# EAGLE design SparkFun_RF_Transceiver-RFM22B (EAGLE 7.2.0)
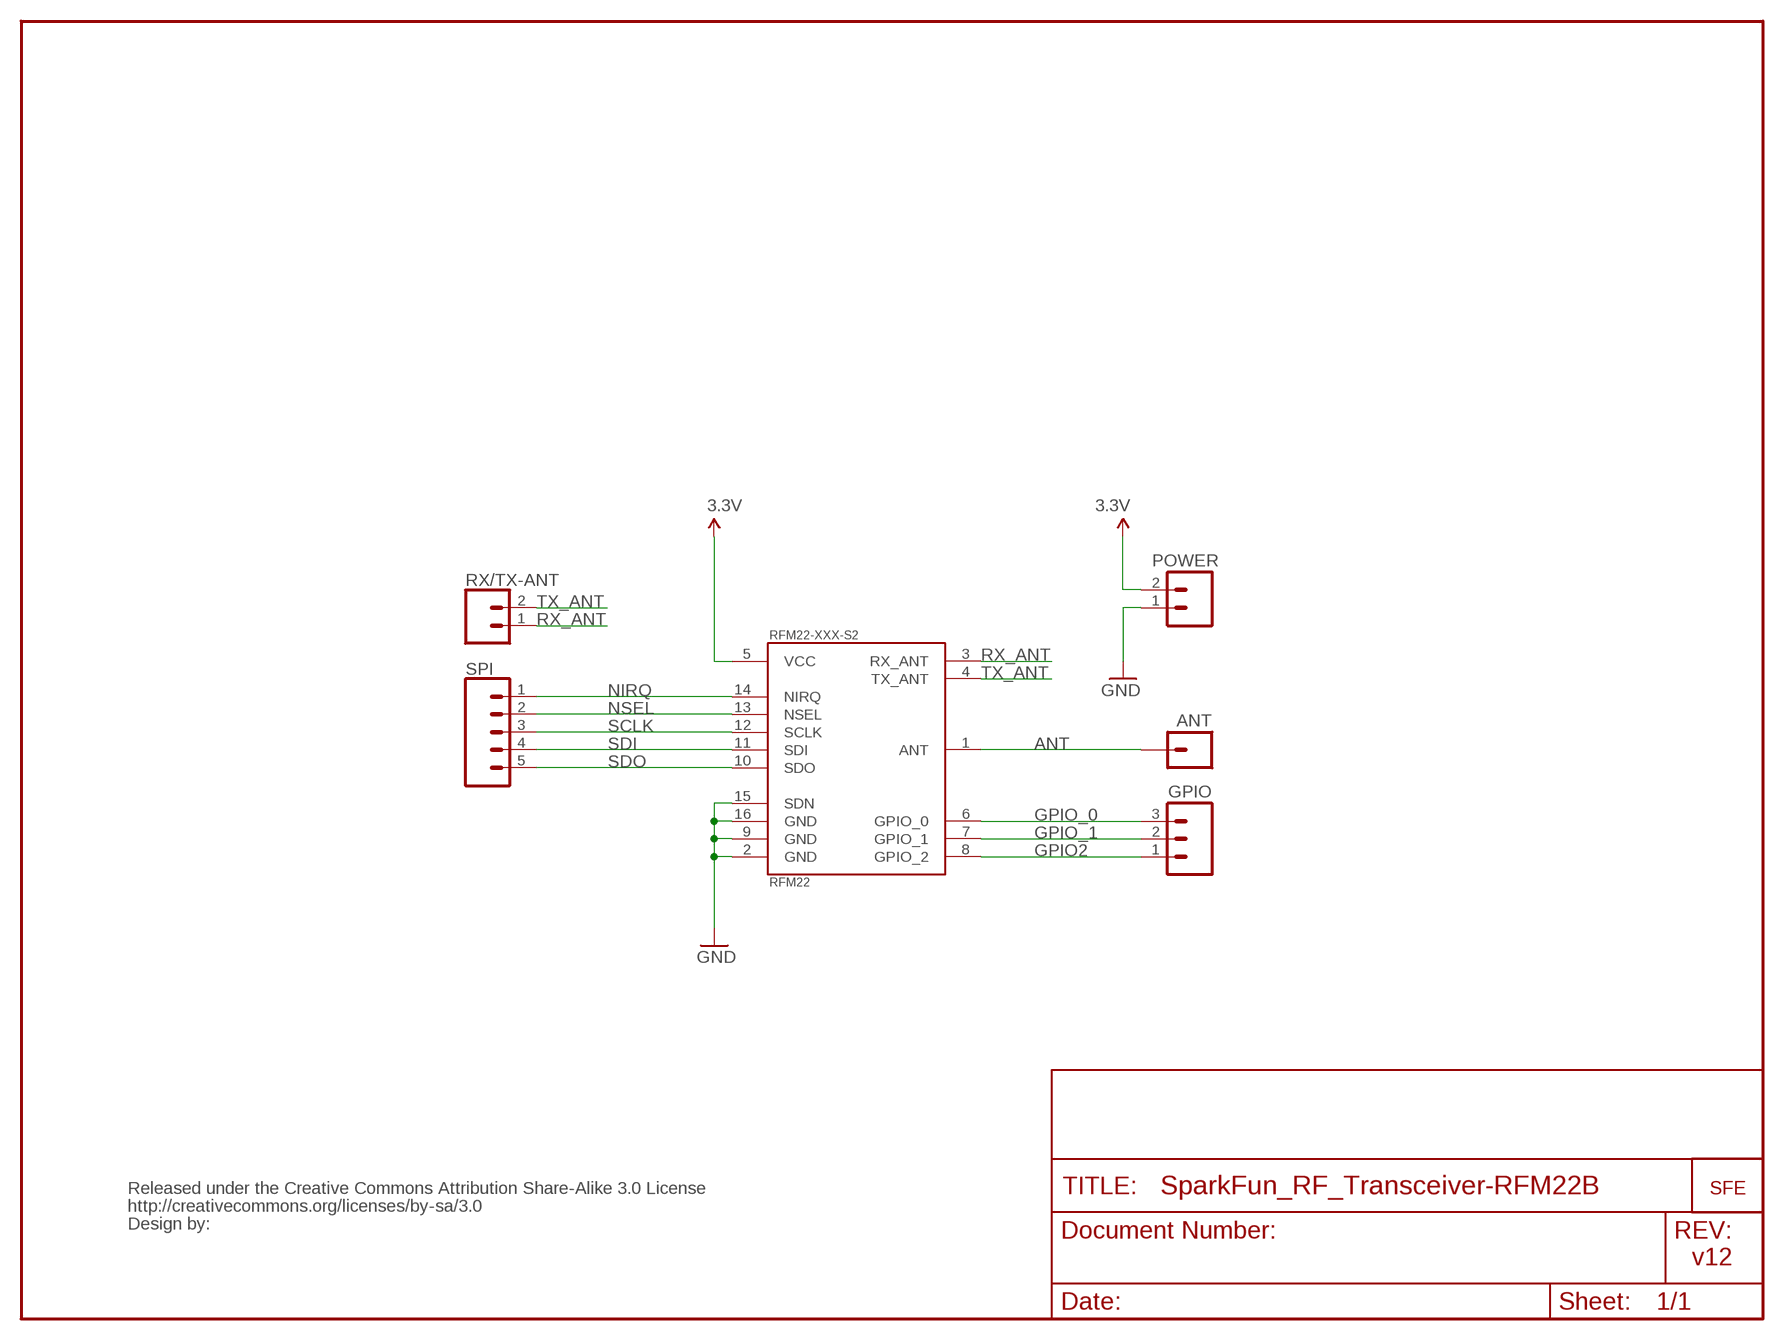
[diagram p0: schematic, sheet 1]

## Parts
JP0  POWER  M02PTH  [1X02]
JP1  LOGO-SFENEW  [SFE-NEW-WEBLOGO]
JP2  ANT  M01PTH  [1X01]
JP3  GPIO  M03PTH  [1X03]
JP4  SPI  M05PTH  [1X05]
JP5  RX/TX-ANT  M02PTH  [1X02]
RFM22-XXX-S2  RFM22  [RFM22-XXX-S2]
U$1  CREATIVE_COMMONS  [CREATIVE_COMMONS]

## Nets
3.3V: JP0.2 RFM22-XXX-S2.5(VCC)
ANT: JP2.1 RFM22-XXX-S2.1(ANT)
GND: JP0.1 RFM22-XXX-S2.2(GND) RFM22-XXX-S2.9(GND) RFM22-XXX-S2.15(SDN) RFM22-XXX-S2.16(GND)
GPIO2: JP3.1 RFM22-XXX-S2.8(GPIO_2)
GPIO_0: JP3.3 RFM22-XXX-S2.6(GPIO_0)
GPIO_1: JP3.2 RFM22-XXX-S2.7(GPIO_1)
NIRQ: JP4.1 RFM22-XXX-S2.14(NIRQ)
NSEL: JP4.2 RFM22-XXX-S2.13(NSEL)
RX_ANT: JP5.1 RFM22-XXX-S2.3(RX_ANT)
SCLK: JP4.3 RFM22-XXX-S2.12(SCLK)
SDI: JP4.4 RFM22-XXX-S2.11(SDI)
SDO: JP4.5 RFM22-XXX-S2.10(SDO)
TX_ANT: JP5.2 RFM22-XXX-S2.4(TX_ANT)

## Notes on the sheet
- v12

## Library data of the parts
JP0 JP5 = SparkFun:M02: Header 2 Standard 2-pin 0.1" header. Use with straight break away headers (SKU : PRT-00116), right angle break away headers (PRT-00553), swiss pins (PRT-00743), machine pins (PRT-00117), and female headers (PRT-00115). Molex polarized connector foot print use with SKU : PRT-08233 with associated crimp pins and housings.
JP1 = SparkFun:LOGO-SFE: Spark Fun Electronics PCB Logo This is the standard Spark Fun Electronics PCB logo.
JP2 = SparkFun:M01: Header 1 Standard 1-pin 0.1" header. Use with straight break away headers (SKU : PRT-00116), right angle break away headers (PRT-00553), swiss pins (PRT-00743), machine pins (PRT-00117), and female headers (PRT-00115).
JP3 = SparkFun:M03: Header 3 Standard 3-pin 0.1" header. Use with straight break away headers (SKU : PRT-00116), right angle break away headers (PRT-00553), swiss pins (PRT-00743), machine pins (PRT-00117), and female headers (PRT-00115). Molex polarized connector foot print use with SKU : PRT-08232 with associated crimp pins and housings.
JP4 = SparkFun:M05: Header 5 Standard 5-pin 0.1" header. Use with straight break away headers (SKU : PRT-00116), right angle break away headers (PRT-00553), swiss pins (PRT-00743), machine pins (PRT-00117), and female headers (PRT-00115). Molex polarized connector foot print use with SKU : PRT-08230 with associated crimp pins and housings.
RFM22-XXX-S2 = SparkFun:RFM22: *Hope RF's RFM22* Packages: RFM22-S2 (SMD)
U$1 = SparkFun:CREATIVE_COMMONS

## Board
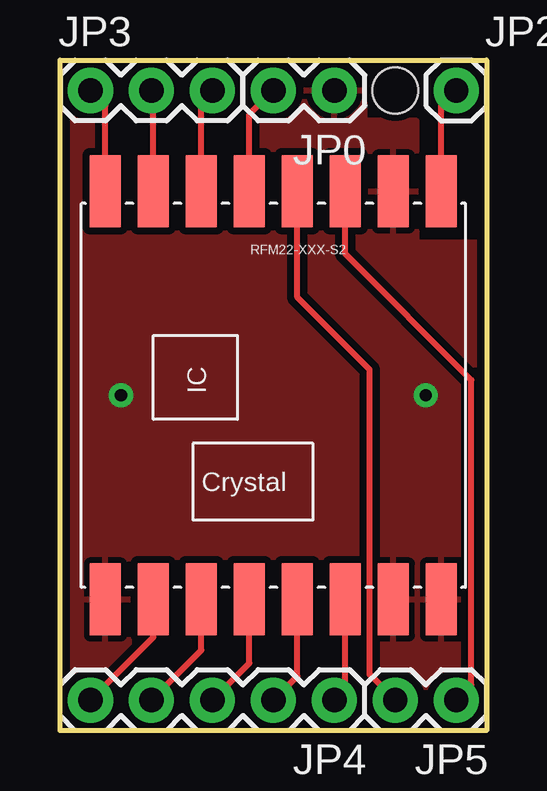
[diagram p1: board, top side]
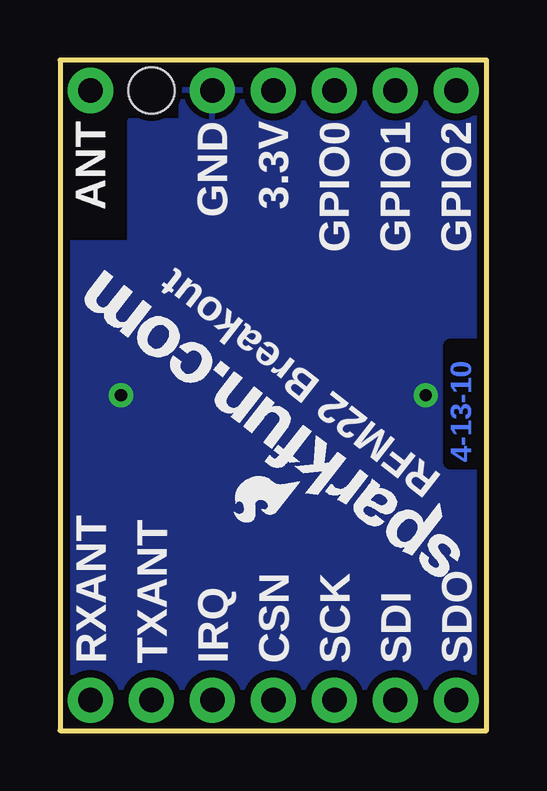
[diagram p2: board, bottom side, seen from below]

Size 17.78 x 27.94 mm. Coordinates in mm from the lower left corner, seen from the top.
Outline: 0,0 0,27.94 17.78,27.94 17.78,0 0,0
Copper layers (1*16): Top 0.035mm / dielectric 1.5mm / Bottom 0.035mm
Design rules "SparkFun": minimum track width 8mil, minimum drill 20mil, track to track 8mil, track to pad 8mil, pad to pad 8mil, via to via 8mil, smd to smd 8mil, copper to edge 9mil, drill to drill 8mil, minimum pad ring 12mil, minimum via ring 10mil, stop-mask expansion 4mil, vias tented up to drill 20mil, thermal gap 10mil
Holes 1.91 mm at 13.97,26.67

### Footprints (pad centres in the part's own frame; a part is rotated, then mirrored left to right if it is on the bottom)
1X02 = drill 1.016 pad 1.88: 1 0,0; 2 2.54,0
1X01 = drill 1.016 pad 1.88: 1 0,0
1X03 = drill 1.016 pad 1.88: 1 0,0; 2 2.54,0; 3 5.08,0
1X05 = drill 1.016 pad 1.88: 1 0,0; 2 2.54,0; 3 5.08,0; 4 7.62,0; 5 10.16,0
RFM22-XXX-S2 = smd 3 x 1.3: 1 -8.5,7; 2 -8.5,5; 3 -8.5,3; 4 -8.5,1; 5 -8.5,-1; 6 -8.5,-3; 7 -8.5,-5; 8 -8.5,-7; 9 8.5,-7; 10 8.5,-5; 11 8.5,-3; 12 8.5,-1; 13 8.5,1; 14 8.5,3; 15 8.5,5; 16 8.5,7

### Placement (x,y rotation side)
JP0  11.43,26.67 180 top
JP1  0.33,8.21 142 bottom
JP2  16.51,26.67 0 top
JP3  1.27,26.67 0 top
JP4  11.43,1.27 180 top
JP5  16.51,1.27 180 top
RFM22-XXX-S2  8.89,13.97 270 top
U$1  20.32,-11.43 0 top  (outside the outline)

### Tracks (layer width: path | path; a pad name or v marks a point on that pad's centre or on a via)
3.3V
  Top 0.254: RFM22-XXX-S2.5 7.89,25.67 JP0.2
ANT
  Top 0.254: RFM22-XXX-S2.1 15.89,26.05 JP2.1
GND  (via drill 0.51)
  other vias: 2.54,13.97 15.24,13.97
  pour Bottom (isolate 0.305): 14.86,20.32 14.86,25.4 12.7,25.4 12.7,27.94 0,27.94 0,0 17.78,0 17.78,20.32 15.24,20.32
  pour Top (isolate 0.305): 14.86,20.32 14.86,25.4 12.7,25.4 12.7,27.94 0,27.94 0,0 17.78,0 17.78,20.32 15.24,20.32
GPIO2
  Top 0.254: RFM22-XXX-S2.8 1.89,26.05 JP3.1
GPIO_0
  Top 0.254: RFM22-XXX-S2.6 5.89,26.21 JP3.3
GPIO_1
  Top 0.254: RFM22-XXX-S2.7 3.89,26.59 JP3.2
NIRQ
  Top 0.254: JP4.1 11.89,1.73 RFM22-XXX-S2.14
NSEL
  Top 0.254: JP4.2 9.89,2.27 RFM22-XXX-S2.13
RX_ANT
  Top 0.254: JP5.1 17.14,1.91 17.14,14.61 11.89,19.86 RFM22-XXX-S2.3
SCLK
  Top 0.254: JP4.3 7.89,2.81 RFM22-XXX-S2.12
SDI
  Top 0.254: JP4.4 5.89,3.35 RFM22-XXX-S2.11
SDO
  Top 0.254: 1.35,1.35 JP4.5 3.89,3.89 RFM22-XXX-S2.10
TX_ANT
  Top 0.254: JP5.2 12.9,2.34 12.9,15.04 9.89,18.05 RFM22-XXX-S2.4

### Text on the board
Bottom: 4-13-10
bPlace: GPIO2 | GPIO1 | GPIO0 | 3.3V | GND | ANT | RFM22 Breakout | SDO | SDI | SCK | CSN | IRQ | TXANT | RXANT